# Altium schematic sheet io.SchDoc
size A2; SheetNumber: 3; SheetTotal: 4
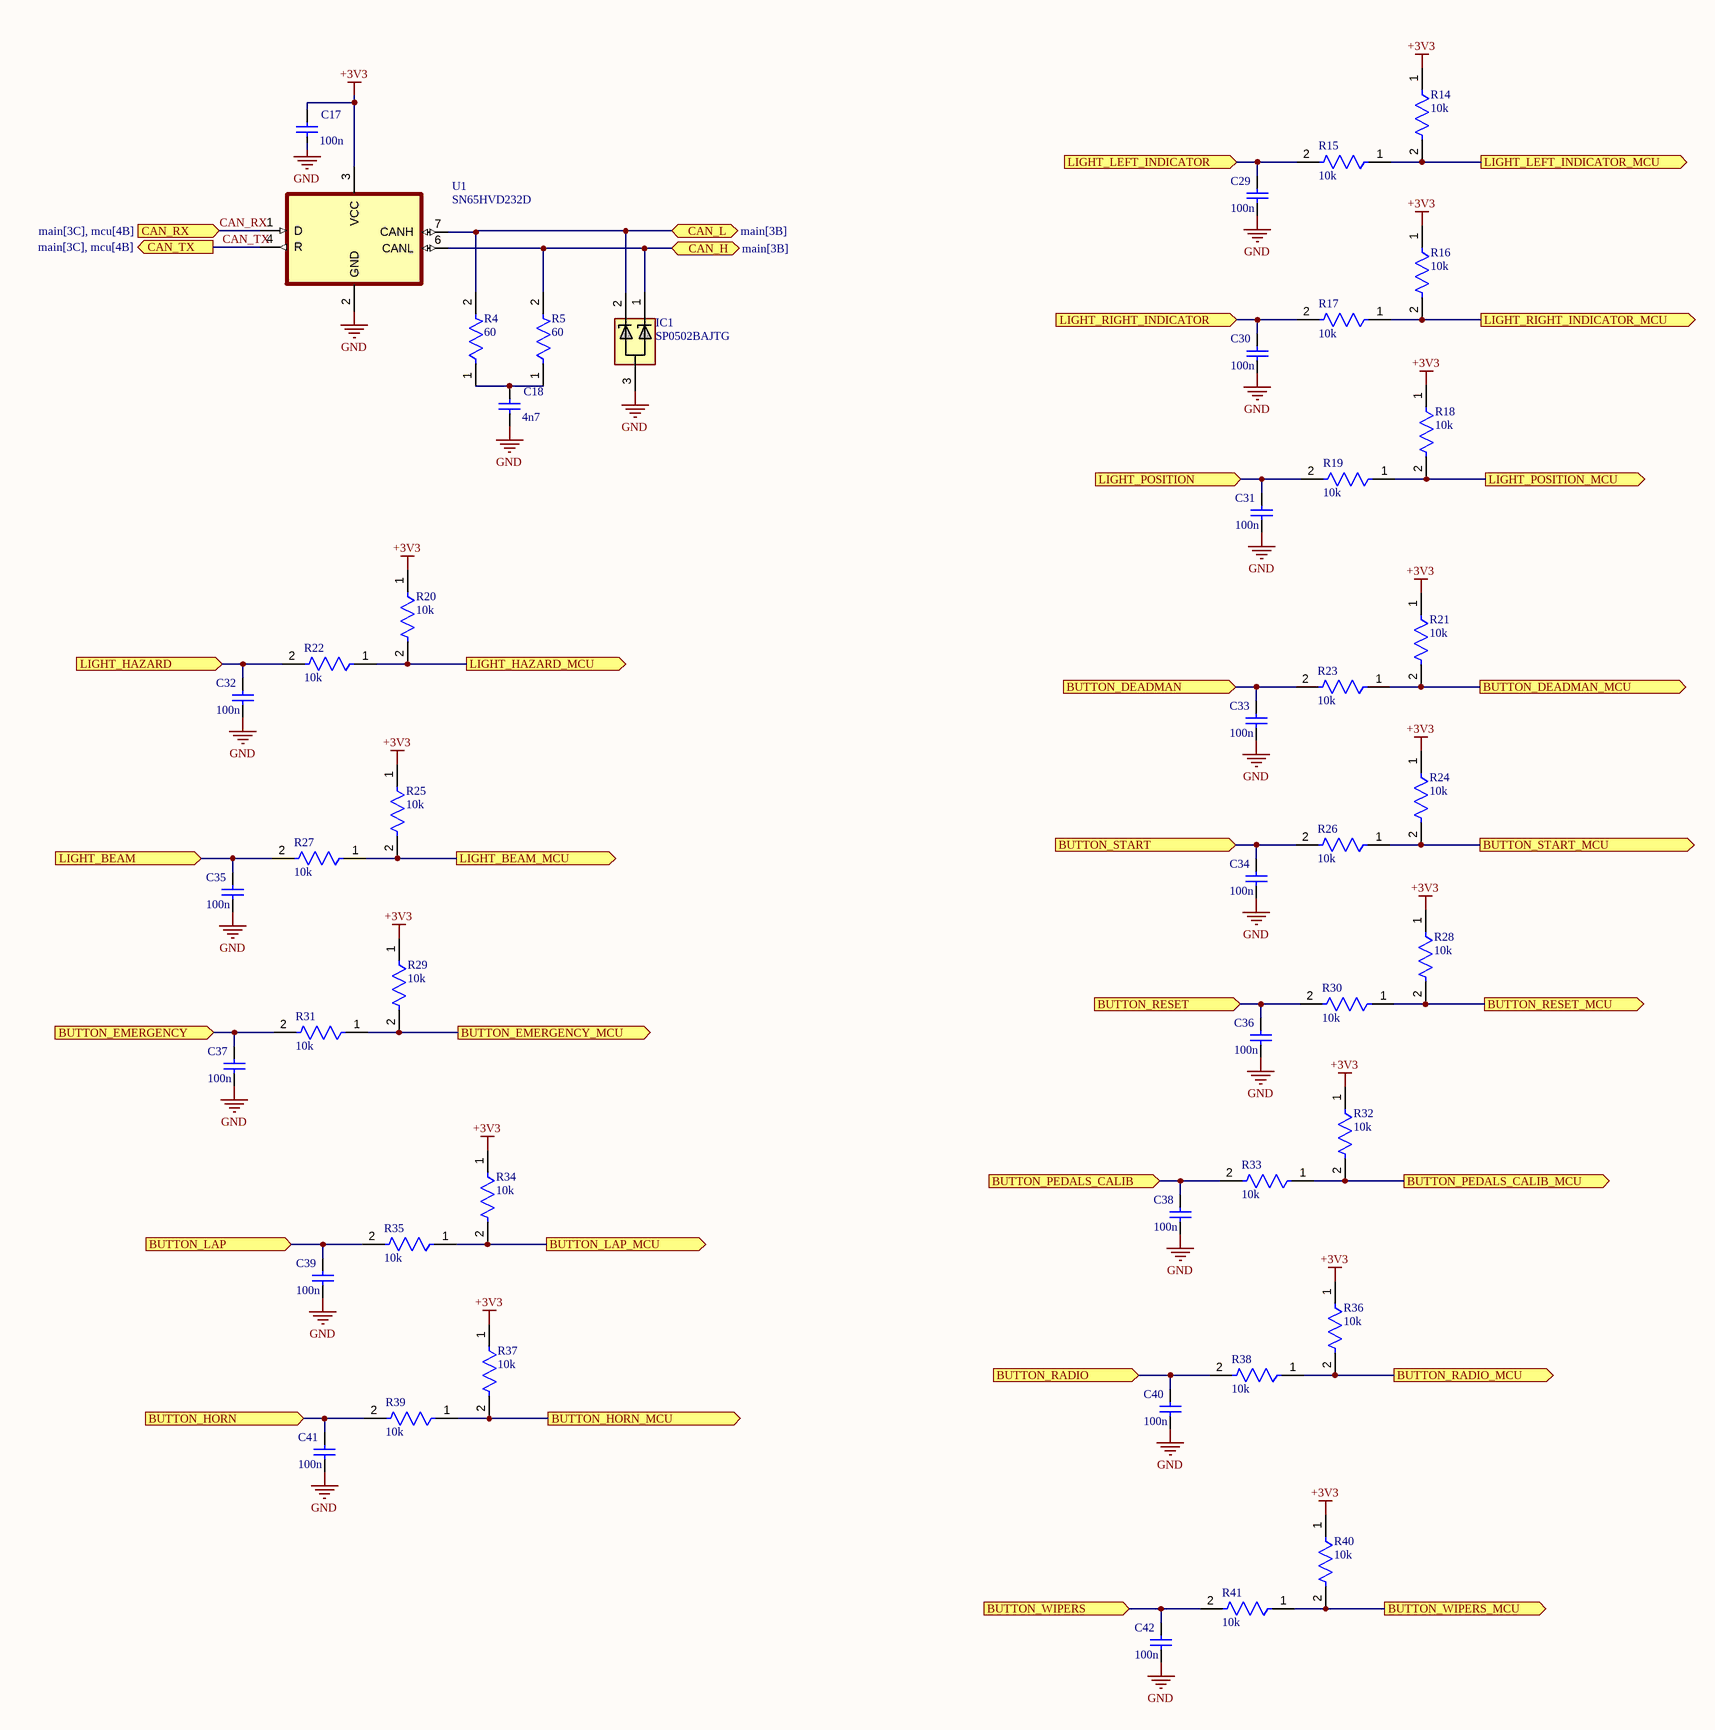
[diagram p0: io.SchDoc]

## Parts
C17  100n  [CAPC1206(3216)150_L]
C18  4n7  [CAPC1206(3216)150_L]
C29  100n  [CAPC1206(3216)150_L]
C30  100n  [CAPC1206(3216)150_L]
C31  100n  [CAPC1206(3216)150_L]
C32  100n  [CAPC1206(3216)150_L]
C33  100n  [CAPC1206(3216)150_L]
C34  100n  [CAPC1206(3216)150_L]
C35  100n  [CAPC1206(3216)150_L]
C36  100n  [CAPC1206(3216)150_L]
C37  100n  [CAPC1206(3216)150_L]
C38  100n  [CAPC1206(3216)150_L]
C39  100n  [CAPC1206(3216)150_L]
C40  100n  [CAPC1206(3216)150_L]
C41  100n  [CAPC1206(3216)150_L]
C42  100n  [CAPC1206(3216)150_L]
IC1  SP0502BAJTG  [SOT132P220X110-3N]
R4  60  [FP-RK73H2B-MFG]
R5  60  [FP-RK73H2B-MFG]
R14  10k  [FP-RK73H2B-MFG]
R15  10k  [FP-RK73H2B-MFG]
R16  10k  [FP-RK73H2B-MFG]
R17  10k  [FP-RK73H2B-MFG]
R18  10k  [FP-RK73H2B-MFG]
R19  10k  [FP-RK73H2B-MFG]
R20  10k  [FP-RK73H2B-MFG]
R21  10k  [FP-RK73H2B-MFG]
R22  10k  [FP-RK73H2B-MFG]
R23  10k  [FP-RK73H2B-MFG]
R24  10k  [FP-RK73H2B-MFG]
R25  10k  [FP-RK73H2B-MFG]
R26  10k  [FP-RK73H2B-MFG]
R27  10k  [FP-RK73H2B-MFG]
R28  10k  [FP-RK73H2B-MFG]
R29  10k  [FP-RK73H2B-MFG]
R30  10k  [FP-RK73H2B-MFG]
R31  10k  [FP-RK73H2B-MFG]
R32  10k  [FP-RK73H2B-MFG]
R33  10k  [FP-RK73H2B-MFG]
R34  10k  [FP-RK73H2B-MFG]
R35  10k  [FP-RK73H2B-MFG]
R36  10k  [FP-RK73H2B-MFG]
R37  10k  [FP-RK73H2B-MFG]
R38  10k  [FP-RK73H2B-MFG]
R39  10k  [FP-RK73H2B-MFG]
R40  10k  [FP-RK73H2B-MFG]
R41  10k  [FP-RK73H2B-MFG]
U1  SN65HVD232D  [SN65HVD232D]

## Ports
BUTTON_DEADMAN (in), BUTTON_DEADMAN_MCU (out), BUTTON_EMERGENCY (in), BUTTON_EMERGENCY_MCU (out), BUTTON_HORN (in), BUTTON_HORN_MCU (out), BUTTON_LAP (in), BUTTON_LAP_MCU (out), BUTTON_PEDALS_CALIB (in), BUTTON_PEDALS_CALIB_MCU (out), BUTTON_RADIO (in), BUTTON_RADIO_MCU (out), BUTTON_RESET (in), BUTTON_RESET_MCU (out), BUTTON_START (in), BUTTON_START_MCU (out), BUTTON_WIPERS (in), BUTTON_WIPERS_MCU (out), CAN_H (bidir, see main[3B]), CAN_L (bidir, see main[3B]), CAN_RX (in, see main[3C], mcu[4B]), CAN_TX (out, see main[3C], mcu[4B]), LIGHT_BEAM (in), LIGHT_BEAM_MCU (out), LIGHT_HAZARD (in), LIGHT_HAZARD_MCU (out), LIGHT_LEFT_INDICATOR (in), LIGHT_LEFT_INDICATOR_MCU (out), LIGHT_POSITION (in), LIGHT_POSITION_MCU (out), LIGHT_RIGHT_INDICATOR (in), LIGHT_RIGHT_INDICATOR_MCU (out)

## Nets
+3V3: C17.1 R14.1 R16.1 R18.1 R20.1 R21.1 R24.1 R25.1 R28.1 R29.1 R32.1 R34.1 R36.1 R37.1 R40.1 U1.3(VCC)
GND: C17.2 C18.2 C29.2 C30.2 C31.2 C32.2 C33.2 C34.2 C35.2 C36.2 C37.2 C38.2 C39.2 C40.2 C41.2 C42.2 IC1.3 U1.2(GND)
BUTTON_DEADMAN: C33.1 R23.2 ; port BUTTON_DEADMAN
BUTTON_DEADMAN_MCU: R21.2 R23.1 ; port BUTTON_DEADMAN_MCU
BUTTON_EMERGENCY: C37.1 R31.2 ; port BUTTON_EMERGENCY
BUTTON_EMERGENCY_MCU: R29.2 R31.1 ; port BUTTON_EMERGENCY_MCU
BUTTON_HORN: C41.1 R39.2 ; port BUTTON_HORN
BUTTON_HORN_MCU: R37.2 R39.1 ; port BUTTON_HORN_MCU
BUTTON_LAP: C39.1 R35.2 ; port BUTTON_LAP
BUTTON_LAP_MCU: R34.2 R35.1 ; port BUTTON_LAP_MCU
BUTTON_PEDALS_CALIB: C38.1 R33.2 ; port BUTTON_PEDALS_CALIB
BUTTON_PEDALS_CALIB_MCU: R32.2 R33.1 ; port BUTTON_PEDALS_CALIB_MCU
BUTTON_RADIO: C40.1 R38.2 ; port BUTTON_RADIO
BUTTON_RADIO_MCU: R36.2 R38.1 ; port BUTTON_RADIO_MCU
BUTTON_RESET: C36.1 R30.2 ; port BUTTON_RESET
BUTTON_RESET_MCU: R28.2 R30.1 ; port BUTTON_RESET_MCU
BUTTON_START: C34.1 R26.2 ; port BUTTON_START
BUTTON_START_MCU: R24.2 R26.1 ; port BUTTON_START_MCU
BUTTON_WIPERS: C42.1 R41.2 ; port BUTTON_WIPERS
BUTTON_WIPERS_MCU: R40.2 R41.1 ; port BUTTON_WIPERS_MCU
CAN_H: IC1.1 R5.2 U1.6(CANL) ; port CAN_H
CAN_L: IC1.2 R4.2 U1.7(CANH) ; port CAN_L
CAN_RX: U1.1(D) ; port CAN_RX
CAN_TX: U1.4(R) ; port CAN_TX
LIGHT_BEAM: C35.1 R27.2 ; port LIGHT_BEAM
LIGHT_BEAM_MCU: R25.2 R27.1 ; port LIGHT_BEAM_MCU
LIGHT_HAZARD: C32.1 R22.2 ; port LIGHT_HAZARD
LIGHT_HAZARD_MCU: R20.2 R22.1 ; port LIGHT_HAZARD_MCU
LIGHT_LEFT_INDICATOR: C29.1 R15.2 ; port LIGHT_LEFT_INDICATOR
LIGHT_LEFT_INDICATOR_MCU: R14.2 R15.1 ; port LIGHT_LEFT_INDICATOR_MCU
LIGHT_POSITION: C31.1 R19.2 ; port LIGHT_POSITION
LIGHT_POSITION_MCU: R18.2 R19.1 ; port LIGHT_POSITION_MCU
LIGHT_RIGHT_INDICATOR: C30.1 R17.2 ; port LIGHT_RIGHT_INDICATOR
LIGHT_RIGHT_INDICATOR_MCU: R16.2 R17.1 ; port LIGHT_RIGHT_INDICATOR_MCU
NetC18_1: C18.1 R4.1 R5.1

## Notes on the sheet
- DWG. NO.
- REV.
- SHT.
- REVISION
- DESCRIPTION
- DATE
- APPROVED
- THIS DOCUMENT AND THE DATA DISCLOSED HEREIN OR HEREWITH IS THE PROPERTY OF ALTIUM LIMITED AND MAY BE FREELY DISTRIBUTED IN WHOLE. NO RIGHTS ARE RESERVED OR EXPRESS OR IMPLIED WARANTEE GIVEN.
- ENG:
- DSN:
- APPROVALS
- PROJECT
- DOCUMENT REVISION:
- DESIGN ITEM:
- CHK:
- BOM:
- REFERENCE DOCUMENTS
- PROJECT REVISION:
- TITLE
- FAB DWG:
- PCB DWG:
- ASSY DWG:
- SCALE:
- SIZE
- C
- CAGE CODE
- FILE NAME
- DWG NO.
- SHEET
- OF
- REV

## Library data of the parts
C17 C18 C29-C42 = CMP-1037-04778-1: CAP 1.8uF 10V ±5% 1206 (3216 Metric) Thickness 1.45mm SMD; Case-EIA: 1206; Tolerance: Â±5%; Case-Metric: 3216; Technology: SMT; Value: 1.8uF; Rated Voltage: 10 V; Max Thickness: 1.45 mm
IC1 = SP0502BAJTG: Integrated Circuit; Manufacturer_Name: LITTELFUSE; Datasheet Link: https://www.littelfuse.com/~/media/electronics/datasheets/tvs_diode_arrays/littelfuse_tvs_diode_array_sp05_datasheet.pdf.pdf; Height: 1.1mm; Manufacturer_Part_Number: SP0502BAJTG; Mouser Part Number: 576-SP0502BAJTG; Mouser Price/Stock: https://www.mouser.co.uk/ProductDetail/Littelfuse/SP0502BAJTG?qs=RnOBYWd%2Fz7cttN1Mwg4HWA%3D%3D; Arrow Part Number: SP0502BAJTG; Arrow Price/Stock: https://www.arrow.com/en/products/sp0502bajtg/littelfuse?region=nac
R4 R5 R14-R41 = CMP-04015-098385-1: 40.2kΩ ±1% 0.25W Chip Resistor 1206 Thick Film AEC-Q200 Qualified; Resistance: 40.2kR; Voltage Rating (DC): 200V; Temperature Coefficient: 100ppm/°C; Power Rating: 250mW; Tolerance: 1%; Package Quantity: 5000; Length: 3.2mm; Termination: SMD/SMT; Lead Free: Contains Lead; Case Code (Imperial): 1206; Case/Package: 1206; Voltage Rating: 200V; Case Code (Metric): 3216; Max Operating Temperature: 155°C; Packaging: Tape and Reel; Width: 1.6mm; Series: RK73H; Min Operating Temperature: -55°C; RoHS Compliant: No; Height: 0.6mm
U1 = SN65HVD232D: Texas Instruments - SN65HVD232DR - Can Transceiver, 1MBPS, 1/1, 3.3V, SOIC-8, Full Reel; Manufacturer Lifecycle Status: ACTIVE; Max Supply Voltage: 3.6V; Min Supply Voltage: 3V; Nominal Supply Current: 17mA; Number of Drivers: 1; SnapEDA_Link: https://www.snapeda.com/parts/SN65HVD232D/Texas+Instruments/view-part/?ref=snap; Package: SOIC-8 Texas Instruments; Value: *; MF: Texas Instruments; MP: SN65HVD232D; Check_prices: https://www.snapeda.com/parts/SN65HVD232D/Texas+Instruments/view-part/?ref=eda; Supplier: Arrow Electronics; Supplier Part Number: SN65HVD232DR; Manufacturer: Texas Instruments; Manufacturer Part Number: SN65HVD232DR; RoHS: Compliant; Category: CAN Transceivers; Stock: 10000; Pricing: 2500=1,1159, 5000=1,076, 7500=1,062 (USD); Case/Package: SOIC; Data Rate: 1Mbps; Height: 1.75mm; Lead Free: Lead Free; Length: 4.9mm; Lifecycle Status: Production; Max Operating Temperature: 85°C; Min Operating Temperature: -40°C; Pins: 8; Number of Receive Buffers: 1; Number of Receivers: 1; Number of Transceivers: 1; Number of Transmit Buffers: 1; Packaging: Cut Tape; Radiation Hardening: No; REACH SVHC: No; Schedule B: 8542390000, 8542390000|8542390000|8542390000|8542390000|8542390000; Thickness: 1.58mm; Weight: 72.603129mg; Width: 3.91mm; ComponentLink1URL: https://octopart.com:443/opatz8j6/c1?t=KNMFt9M64p-_id6rZ0-P1CX6CGmvk_NFg0bt7DHXbi_P10EFF0MZE_9gM8ERckOxIywTBgDrXd4Bw1XwEAcVVdK92p9CEfdSNaVajf6_bxnez3EeN1RE1wZBaojbXTwQ_101S7Bb856c3hUAWErS0_zGIM1B6Z6dFQwv_Ps2SUdVVUCjmJkLnMLZKTBWfnIVcgJIheW78JYanUyW_1u-I93chBuiSPXQYIk2xXb9JgOyrE9lHEnesRSQq9luJOd1yknyGQP0N3Is0_dGM9QrGV5UOgjoada9tMnQwKJP8gahr3iTK59XJFH6OfbHTOm3R9BdESCrBMbrE2MVOGPPkVOTrqf0YMovDpmf-konbncFnSES8CNOhHqMwHv2HEwKcPoK44nl&src-supplier=Texas+Instruments; ComponentLink1Description: https://octopart.com:443/opatz8j6/c1?t=KNMFt9M64p-_id6rZ0-P1CX6CGmvk_NFg0bt7DHXbi_P10EFF0MZE_9gM8ERckOxIywTBgDrXd4Bw1XwEAcVVdK92p9CEfdSNaVajf6_bxnez3EeN1RE1wZBaojbXTwQ_101S7Bb856c3hUAWErS0_zGIM1B6Z6dFQwv_Ps2SUdVVUCjmJkLnMLZKTBWfnIVcgJIheW78JYanUyW_1u-I93chBuiSPXQYIk2xXb9JgOyrE9lHEnesRSQq9luJOd1yknyGQP0N3Is0_dGM9QrGV5UOgjoada9tMnQwKJP8gahr3iTK59XJFH6OfbHTOm3R9BdESCrBMbrE2MVOGPPkVOTrqf0YMovDpmf-konbncFnSES8CNOhHqMwHv2HEwKcPoK44nl&src-supplier=Texas+Instruments; ComponentLink2URL: https://sigma.octopart.com:443/49249642/technical_drawing/Texas-Instruments-SN65HVD232DR.pdf?src-supplier=Texas+Instruments; ComponentLink2Description: https://sigma.octopart.com:443/49249642/technical_drawing/Texas-Instruments-SN65HVD232DR.pdf?src-supplier=Texas+Instruments; ComponentLink3URL: https://datasheet.octopart.com:443/SN65HVD232DR-Texas-Instruments-datasheet-81447765.pdf?src-supplier=Upverter; ComponentLink3Description: https://datasheet.octopart.com:443/SN65HVD232DR-Texas-Instruments-datasheet-81447765.pdf?src-supplier=Upverter; ComponentLink4URL: https://datasheet.octopart.com:443/SN65HVD232DR-Texas-Instruments-datasheet-37140773.pdf?src-supplier=Newark; ComponentLink4Description: https://datasheet.octopart.com:443/SN65HVD232DR-Texas-Instruments-datasheet-37140773.pdf?src-supplier=Newark; ComponentLink5URL: https://datasheet.octopart.com:443/SN65HVD232DR-Texas-Instruments-datasheet-14436966.pdf?src-supplier=Newark; ComponentLink5Description: https://datasheet.octopart.com:443/SN65HVD232DR-Texas-Instruments-datasheet-14436966.pdf?src-supplier=Newark; ComponentLink6URL: https://datasheet.octopart.com:443/SN65HVD232DR-Texas-Instruments-datasheet-58296547.pdf?src-supplier=Newark; ComponentLink6Description: https://datasheet.octopart.com:443/SN65HVD232DR-Texas-Instruments-datasheet-58296547.pdf?src-supplier=Newark; ComponentLink7URL: https://datasheet.octopart.com:443/SN65HVD232DR-Texas-Instruments-datasheet-48117850.pdf?src-supplier=Newark; ComponentLink7Description: https://datasheet.octopart.com:443/SN65HVD232DR-Texas-Instruments-datasheet-48117850.pdf?src-supplier=Newark; ComponentLink8URL: https://datasheet.octopart.com:443/SN65HVD232DR-Texas-Instruments-datasheet-10256024.pdf?src-supplier=Arrow+Electronics; ComponentLink8Description: https://datasheet.octopart.com:443/SN65HVD232DR-Texas-Instruments-datasheet-10256024.pdf?src-supplier=Arrow+Electronics; ComponentLink9URL: https://datasheet.octopart.com:443/SN65HVD232DR-Texas-Instruments-datasheet-149765.pdf?src-supplier=Mouser; ComponentLink9Description: https://datasheet.octopart.com:443/SN65HVD232DR-Texas-Instruments-datasheet-149765.pdf?src-supplier=Mouser; ComponentLink10URL: https://datasheet.octopart.com:443/SN65HVD232DR-Texas-Instruments-datasheet-62292544.pdf?src-supplier=Farnell; ComponentLink10Description: https://datasheet.octopart.com:443/SN65HVD232DR-Texas-Instruments-datasheet-62292544.pdf?src-supplier=Farnell; ComponentLink11URL: https://datasheet.octopart.com:443/SN65HVD232DR-Texas-Instruments-datasheet-164416263.pdf?src-supplier=SHENGYU+ELECTRONICS; ComponentLink11Description: https://datasheet.octopart.com:443/SN65HVD232DR-Texas-Instruments-datasheet-164416263.pdf?src-supplier=SHENGYU+ELECTRONICS; ComponentLink12URL: https://datasheet.octopart.com:443/SN65HVD232DR-Texas-Instruments-datasheet-159115712.pdf?src-supplier=LCSC; ComponentLink12Description: https://datasheet.octopart.com:443/SN65HVD232DR-Texas-Instruments-datasheet-159115712.pdf?src-supplier=LCSC; ComponentLink13URL: https://datasheet.octopart.com:443/SN65HVD232DR-Texas-Instruments-datasheet-137316104.pdf?src-supplier=Future+Electronics; ComponentLink13Description: https://datasheet.octopart.com:443/SN65HVD232DR-Texas-Instruments-datasheet-137316104.pdf?src-supplier=Future+Electronics; ComponentLink14URL: https://datasheet.octopart.com:443/SN65HVD232DR-Texas-Instruments-datasheet-8625468.pdf?src-supplier=Verical; ComponentLink14Description: https://datasheet.octopart.com:443/SN65HVD232DR-Texas-Instruments-datasheet-8625468.pdf?src-supplier=Verical; ComponentLink15URL: https://datasheet.octopart.com:443/SN65HVD232DR-Texas-Instruments-datasheet-8378736.pdf?src-supplier=Verical; ComponentLink15Description: https://datasheet.octopart.com:443/SN65HVD232DR-Texas-Instruments-datasheet-8378736.pdf?src-supplier=Verical; ComponentLink16URL: http://sigma.octopart.com:80/conflict_mineral_statement/Texas-Instruments-company-63.pdf?src-supplier=Compliance+Statements; ComponentLink16Description: http://sigma.octopart.com:80/conflict_mineral_statement/Texas-Instruments-company-63.pdf?src-supplier=Compliance+Statements; ComponentLink17URL: http://sigma.octopart.com:80/reach_statement/Texas-Instruments-company-64.pdf?src-supplier=Compliance+Statements; ComponentLink17Description: http://sigma.octopart.com:80/reach_statement/Texas-Instruments-company-64.pdf?src-supplier=Compliance+Statements